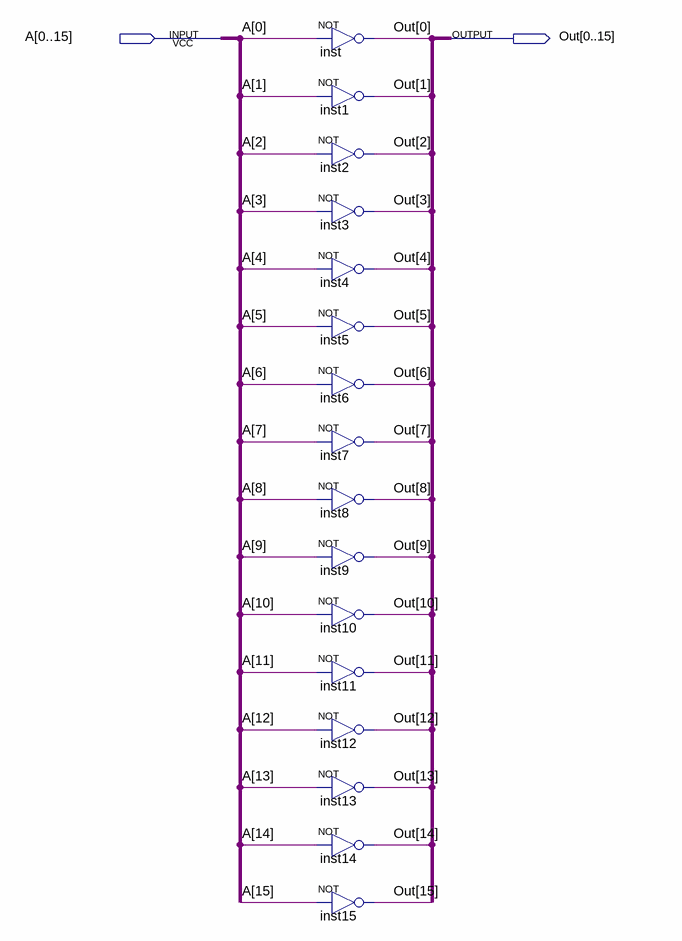
[diagram p0: schematic sheet]
// Quartus schematic not_bus16.bdf as structural Verilog: 16 symbols, 2 pins
module not_bus16 (
  input  [0:15] A,
  output [0:15] Out
);

  not inst (Out[0], A[0]);
  not inst1 (Out[1], A[1]);
  not inst2 (Out[2], A[2]);
  not inst3 (Out[3], A[3]);
  not inst4 (Out[4], A[4]);
  not inst5 (Out[5], A[5]);
  not inst6 (Out[6], A[6]);
  not inst7 (Out[7], A[7]);
  not inst8 (Out[8], A[8]);
  not inst9 (Out[9], A[9]);
  not inst10 (Out[10], A[10]);
  not inst11 (Out[11], A[11]);
  not inst12 (Out[12], A[12]);
  not inst13 (Out[13], A[13]);
  not inst14 (Out[14], A[14]);
  not inst15 (Out[15], A[15]);
endmodule
